# Altium schematic sheet Force.SchDoc
size Tabloid
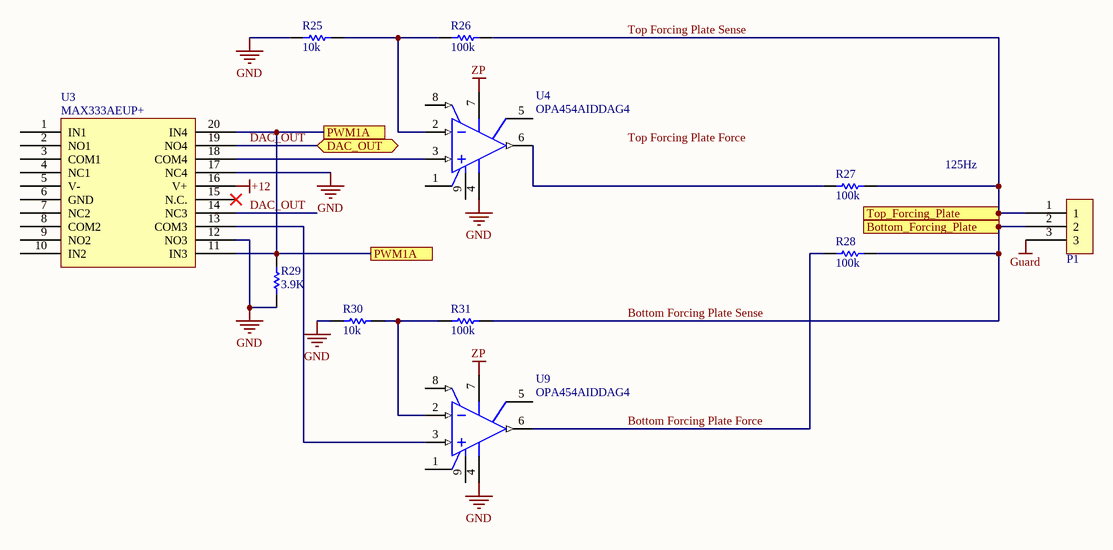
[diagram p0: Force.SchDoc]

## Parts
P1  Triax_Conn  [Triax_Conn]  (value not drawn)
R25  10k  [RESC0402(1005)_M]
R26  100k  [RESC0402(1005)_M]
R27  100k  [RESC0402(1005)_M]
R28  100k  [RESC0402(1005)_M]
R29  3.9K  [RESC0402(1005)_M]
R30  10k  [RESC0402(1005)_M]
R31  100k  [RESC0402(1005)_M]
U3  MAX333AEUP+  [TSOP65P640X90-20N]
U4  OPA454AIDDAG4  [TI-DDA8-2745X2245TP_N]
U9  OPA454AIDDAG4  [TI-DDA8-2745X2245TP_N]

## Ports
Bottom_Forcing_Plate, DAC_OUT, PWM1A, Top_Forcing_Plate

## Nets
+12: U3.16(V+)
GND: R25.1 R29.1 R30.1 U3.12(NO3) U3.17(NC4) U4.4(V-) U9.4(V-)
Guard: P1.3
ZP: U4.7(V+) U9.7(V+)
Bottom Forcing Plate Force: R28.2 U9.6(OUT)
Bottom Forcing Plate Sense: P1.2 R28.1 R31.2 ; port Bottom_Forcing_Plate
DAC_OUT: U3.14(NC3) U3.19(NO4) ; port DAC_OUT
PWM1A: R29.2 U3.11(IN3) U3.20(IN4) ; port PWM1A
Top Forcing Plate Sense: P1.1 R26.2 R27.1 ; port Top_Forcing_Plate
NetR25_2: R25.2 R26.1 U4.2(IN-)
NetR27_2: R27.2 U4.6(OUT)
NetR30_2: R30.2 R31.1 U9.2(IN-)
NetU3_13: U3.13(COM3) U9.3(IN+)
NetU3_18: U3.18(COM4) U4.3(IN+)

Not connected (* = marked no-connect by the designer): U3 1(IN1) 2(NO1) 3(COM1) 4(NC1) 5(V-) 6(GND) 7(NC2) 8(COM2) 9(NO2) 10(IN2) 15(N.C.)*; U4 1(E/D_COM) 5(STATUS_FLAG) 8(E/D) 9(EP); U9 1(E/D_COM) 5(STATUS_FLAG) 8(E/D) 9(EP)

## Notes on the sheet
- 125Hz
- Labels drawn without touching a wire or pin: Top Forcing Plate Force
- Title
- Size:
- Date:
- Tabloid
- Number:
- Time:
- Revision:
- Sheet
- of
- ZLS Corporation
- 7801 North Lamar Blvd.
- Suite E-184
- Austin, Texas 78752  USA
- (512) 453-0288
- File:

## Library data of the parts
R25 R26 R29-R31 = CMP-1011-00463-1
R27 R28 = CMP-1011-00651-1
U3 = MAX333CWP+: IC SWITCH QUAD SPDT 20TSSOP; Manufacturer: Maxim Integrated; Multiplexer/Demultiplexer Circuit: 2:1; On-State Resistance (Max): 45 Ohm; Channel-to-Channel Matching (&Delta;Ron): 2 Ohm (Max); Voltage - Supply, Single (V+): 10 V ~ 30 V; Voltage - Supply, Dual (V±): ±4.5 V ~ 20 V; Switch Time (Ton, Toff) (Max): 175ns, 145ns; Charge Injection: 2pC; Channel Capacitance (CS(off), CD(off)): 5pF; Current - Leakage (IS(off)) (Max): 250pA; Crosstalk: -78dB @ 1MHz; Supplier 1: Digi-Key; Supplier Part Number 1: MAX333AEUP+-ND; Manufacturer Part Number: MAX333AEUP+; RoHS: RoHS Compliant; Category: Integrated Circuits (ICs); Stock 1: 1328; Pricing 1: 1=6.77, 10=6.432, 25=6, 50=5.8942 (USD); Packaging: Tube; Part Status: Active; Switch Circuit: SPDT; -3db Bandwidth: -; Operating Temperature: -40°C ~ 85°C (TA); Package / Case: 20-TSSOP (0.173", 4.40mm Width); Supplier Device Package: 20-TSSOP; Base Part Number: MAX333; ComponentLink1URL: https://pdfserv.maximintegrated.com/en/ds/MAX333A.pdf; ComponentLink1Description: https://pdfserv.maximintegrated.com/en/ds/MAX333A.pdf
U4 U9 = CMP-0017-00715-1: High Voltage (100V), High-Current (50mA) Operational Amplifier, G=1 Stable, 10 to 100 V, -55 to 125 degC, 8-pin SOP (DDA8), Green (RoHS & no Sb/Br); Manufacturer: Texas Instruments; Sub Family: General Purpose Amplifier, High Output Current Amplifier (>=50mA), High Supply Voltage Amplifier (>=30V), Precision Amplifier; Offset Drift(Typ)(uV/C): 1.6; Slew Rate(Typ)(V/us): 13; Number of Channels: 1; Total Supply Voltage(Max)(+5V is 5, +/-5V is 10): 100; Total Supply Voltage(Min)(+5V is 5, +/-5V is 10): 10; Vio (25C)(Max)(mV): 4; GBW(Typ)(MHz): 2.5; Vn at 1kHz(Typ)(nV/rtHz): 47; Rating: Catalog; ComponentLink1URL: http://www.ti.com/; PartNumber: OPA454AIDDAG4; ComponentLink1Description: Manufacturer URL; Eco-Plan: Green (RoHS & no Sb/Br); ComponentLink3URL: http://www.ti.com/litv/pdf/mpds092e; IIB(Max)(pA): 100; ComponentLink2URL: http://www.ti.com/lit/ds/symlink/opa454.pdf; ComponentLink3Description: Package Specification; DatasheetVersion: SBOS391A; Iq per channel(Max)(mA): 4; PackageVersion: 4202561/F, 12/2011; Code_JEDEC: MS-012; CMRR(Min)(dB): 100; PackageReference: DDA8-2745X2245TP; Mounting Technology: Surface Mount; ComponentLink2Description: Datasheet; PackageDescription: 8-Pin PowerPAD(TM) Plastic Small Outline, Body 3.9 x 4.9 mm, Pitch 1.27 mm